# Altium schematic sheet CurrentSense_PowerDistribution.SchDoc
size A; SheetNumber: 3; SheetTotal: 5
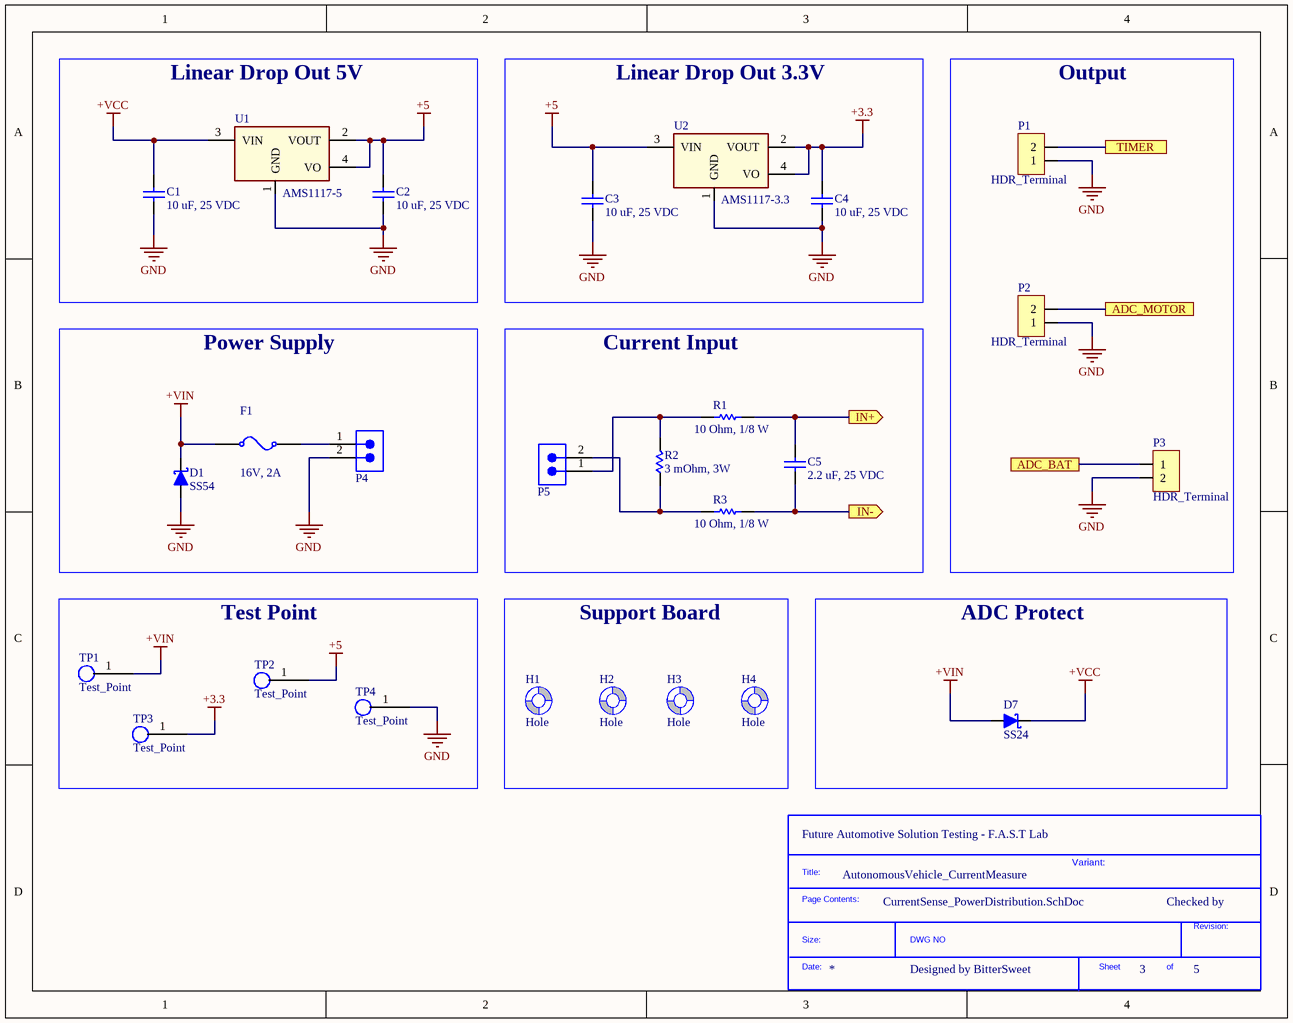
[diagram p0: CurrentSense_PowerDistribution.SchDoc]

## Parts
*?  SDTitleBlock  (value not drawn)  (graphical)
C1  10 uF, 25 VDC  [CAP_0603]
C2  10 uF, 25 VDC  [CAP_0603]
C3  10 uF, 25 VDC  [CAP_0603]
C4  10 uF, 25 VDC  [CAP_0603]
C5  2.2 uF, 25 VDC  [CAP_0805]
D1  SS54  [DO-214AB, SMA]
D7  SS24  [DO-214AB, SMA]
F1  16V, 2A  [Fuse_SMD_1812]
H1  Hole  [Hole_3.2mm]
H2  Hole  [Hole_3.2mm]
H3  Hole  [Hole_3.2mm]
H4  Hole  [Hole_3.2mm]
P1  HDR_Terminal  [HDR_Header_2.54]
P2  HDR_Terminal  [HDR_Header_2.54]
P3  HDR_Terminal  [HDR_Header_2.54]
P4  10A, 300V  [691322310002]  (value not drawn)
P5  10A, 300V  [691322310002]  (value not drawn)
R1  10 Ohm, 1/8 W  [RESISTOR_0805]
R2  3 mOhm, 3W  [RESISTOR-SMD-2512]
R3  10 Ohm, 1/8 W  [RESISTOR_0805]
TP1  Test_Point  [TP_1_5mm_SMD]
TP2  Test_Point  [TP_1_5mm_SMD]
TP3  Test_Point  [TP_1_5mm_SMD]
TP4  Test_Point  [TP_1_5mm_SMD]
U1  AMS1117-5  [AMS1117]
U2  AMS1117-3.3  [AMS1117]

## Blocks framed on the sheet
Linear Drop Out 5V: C1 C2 U1
Linear Drop Out 3.3V: C3 C4 U2
Output: P1-P3
Power Supply: D1 F1 P4
Current Input: C5 P5 R1-R3
Test Point: TP1-TP4
Support Board: H1-H4
ADC Protect: D7

## Ports
ADC_BAT, ADC_MOTOR, IN+ (out), IN- (out), TIMER

## Nets
+3.3: C4.2 TP3.1 U2.2(VOUT) U2.4(VO)
+5: C2.2 C3.2 TP2.1 U1.2(VOUT) U1.4(VO) U2.3(VIN)
+VCC: C1.2 D7.2(K) U1.3(VIN)
+VIN: D1.2(K) D7.1(A) F1.0 TP1.1
GND: C1.1 C2.1 C3.1 C4.1 D1.1(A) P1.1 P2.1 P3.2 P4.2 TP4.1 U1.1(GND) U2.1(GND)
ADC_BAT: P3.1 ; port ADC_BAT
ADC_MOTOR: P2.2 ; port ADC_MOTOR
IN+: C5.2 R1.2 ; port IN+
IN-: C5.1 R3.2 ; port IN-
TIMER: P1.2 ; port TIMER
NetF1_1: F1.1 P4.1
NetP5_1: P5.1 R1.1 R2.2
NetP5_2: P5.2 R2.1 R3.1

Not connected (* = marked no-connect by the designer): H1 1(Screw); H2 1(Screw); H3 1(Screw); H4 1(Screw)

## Notes on the sheet
- (near *?) Future Automotive Solution Testing - F.A.S.T Lab
- AutonomousVehicle_CurrentMeasure
- Variant:
- Checked by
- Designed by BitterSweet
- (in symbol SDTitleBlock) Title:; Page Contents:; Revision:; Size:; DWG NO; Date:; Sheet; of

## Library data of the parts
C1-C4 = 0106031061010: CAP, size 0603, 10 uF, 10 VDC; Manufacture Name: Samsung Electro-Mechanics; Manufacture SN: CL10A106KP8NNWC; Capacitance: 10 uF; Tolerance: +/-10%; Voltage Rating DC: 25 VDC; ComponentLink2Description: Datasheet; ComponentLink2URL: https://www.mouser.vn/datasheet/2/585/MLCC-1837944.pdf; Operating Temperature: -55 to +125degC; Packaging: Tape and Reel; Mounting Technology: SMT; Size: 0603; Supplier 1 Name: Mouser; Supplier 1 SN: 187-CL10A106KP8NNWC; Supplier 1 URL: https://www.mouser.vn/ProductDetail/Samsung-Electro-Mechanics/CL10A106KP8NNWC?qs=xZ%2FP%252Ba9zWqZx8LSX23YqWA%3D%3D&utm_source=mouser-refine-download&utm_medium=file&utm_campaign=CL10A106KP8NNWC&utm_content=Samsung-Electro-Mechanics; Supplier 2 Name: Digi-Key; Supplier 2 SN: 1276-CL10A106KP8NNWCTR-ND; Supplier 2 URL: https://www.digikey.com/en/products/detail/samsung-electro-mechanics/cl10a106kp8nnwc/16572907; Supplier 3 Name: thegioiic; Supplier 3 SN: N/A; Supplier 3 URL: https://www.thegioiic.com/tu-gom-0603-10uf-25v; Value: 10 uF, 25 VDC
C5 = 0108052251025: CAP, size 0805, 2.2 uF, 25 VDC; Manufacture Name: TDK; Manufacture SN: CGA4J3X7R1E225K125AD; Capacitance: 2.2 uF; Tolerance: +/-10%; Voltage Rating DC: 25 VDC; ComponentLink2Description: Datasheet; ComponentLink2URL: https://product.tdk.com/system/files/dam/doc/product/capacitor/ceramic/mlcc/catalog/mlcc_automotive_epoxy_en.pdf?ref_disty=mouser; Operating Temperature: -55 to +125degC; Packaging: Tape and Reel; Mounting Technology: SMT; Size: 0805; Supplier 1 Name: Mouser; Supplier 1 SN: 810-CGA4J3X7R1E225KD; Supplier 1 URL: https://www.mouser.vn/ProductDetail/TDK/CGA4J3X7R1E225K125AD?qs=xLDY6iXSiQZ6drRfaPQTzQ%3D%3D&utm_source=mouser-refine-download&utm_medium=file&utm_campaign=CGA4J3X7R1E225K125AD&utm_content=TDK; Supplier 2 Name: Digi-Key; Supplier 2 SN: 445-9923-2-ND; Supplier 2 URL: https://www.digikey.com/en/products/detail/tdk-corporation/cga4j3x7r1e225k125ad/3933656; Supplier 3 Name: thegioiic; Supplier 3 SN: OEM; Supplier 3 URL: https://www.thegioiic.com/tu-gom-0805-2-2uf-25v; Value: 2.2 uF, 25 VDC
D1 D7 = Diode_Schottky: SS54 SMC Diode Schottky 5A 40V
F1 = 061812200016: Resettable Fuse, Size 1812, 16V, 2A; Manufacturer: Littelfuse; Threshold Current: 40A; Trip Current: 4A; Threshold Voltage: 16V; Hold Current: 2A; Size: 1812; Mounting Technology: SMT/SMD; ComponentLink1Description: Datasheet link; ComponentLink1URL: https://www.littelfuse.com/~/media/electronics/product_specifications/resettable_ptcs/littelfuse_ptc_minismdc300f_2_product_specification.pdf.pdf; ComponentLink2Description: Supplier 1 URL; ComponentLink2URL: https://www.mouser.vn/ProductDetail/Littelfuse/MINISMDC200F-16-2?qs=pBN%2FbMTRZdcH0yqkqvkPxw%3D%3D; ComponentLink3Description: Supplier 2 URL; ComponentLink3URL: https://www.digikey.com/en/products/detail/littelfuse-inc/MINISMDC200F-16-2/6348163?s=N4IgTCBcDaILIEkByCDKcAiBhMAGXAYgPQCMAbALQQC6AvkA; ComponentLink4Description: Supplier 3 URL; ComponentLink4URL: https://www.thegioiic.com/cau-chi-tu-phuc-hoi-1812-16v-2a; Supplier 1 Name: Mouser; Supplier 1 SN: 650-MINISMDC200F/162; Supplier 1 URL: https://www.mouser.vn/ProductDetail/Littelfuse/MINISMDC200F-16-2?qs=pBN%2FbMTRZdcH0yqkqvkPxw%3D%3D; Supplier 2 Name: Digi-Key; Supplier 2 SN: MINISMDC200F/16-2TR-ND; Supplier 2 URL: https://www.mouser.vn/ProductDetail/Littelfuse/MINISMDC200F-16-2?qs=pBN%2FbMTRZdcH0yqkqvkPxw%3D%3D; Supplier 3 Name: thegioiic; Supplier 3 SN: N/A; Supplier 3 URL: https://www.thegioiic.com/cau-chi-tu-phuc-hoi-1812-16v-2a; Value: 16V, 2A
P1-P3 = HDR_Terminal: HDR_Terminal 2 pin; Supplier: ThegioiIC; ComponentLink1Description: URL; ComponentLink1URL: https://www.thegioiic.com/kf128-2-v-domino-2-chan-thang-3-5mm-300v-10a-han-pcb
P4 P5 = 691322310002: WR-TBL Series 322 Horizontal PCB Header, THT, pitch 3.81mm, 2p; Manufacturer: Wurth Elektronik; Modularity: No; ComponentLink1Description: Datasheet Link; ComponentLink1URL: https://www.we-online.com/redexpert/spec/691322310002?ad; ComponentLink2Description: Supplier 1 URL; ComponentLink2URL: N/A; Manufacturer Part Number: 691322310002; Category: Terminal Blocks; Match Code: WR-TBL; Mount: Through Hole; Operating Temperature Max: 105°C; Operating Temperature Min: -40°C; Packaging: Box; Application: Pluggable; Number of Pins: 2; Number of Rows: 1; Orientation: Horizontal; Pitch: 3.81mm; Rated Current: 10A; Working Voltage: 300V; ComponentLink3Description: Supplier 2 URL; ComponentLink3URL: N/A; ComponentLink4Description: Supplier 3 URL; ComponentLink4URL: https://www.thegioiic.com/kf-3-81-2-r-terminal-block-plug-in-han-pcb-2-chan-cong-3-81mm-300v-10a; Supplier 1 Name: Mouser; Supplier 1 SN: N/A; Supplier 1 URL: N/A; Supplier 2 Name: Digi-Key; Supplier 2 SN: N/A; Supplier 2 URL: N/A; Supplier 3 Name: thegioiic; Supplier 3 SN: N/A; Supplier 3 URL: https://www.thegioiic.com/kf-3-81-2-r-terminal-block-plug-in-han-pcb-2-chan-cong-3-81mm-300v-10a; Value: 10A, 300V
R1 R3 = 0008051001: RES, size 0805, 10 Ohm, 1/8 W; Manufacture  Name: Vishay Dale Thin Film; Manufacture  SN: M55342H06B10D0RT5; Resistance tolerance: +/-1%; Rated Power: 1/8 W; Resistance: 10 Ohm; Size: 0805; Mounting Technology: SMT; Supplier 1 Name: Mouser; Supplier 1 SN: 71-CRCW080510R0FKEAH; Supplier 1 URL: https://www.mouser.vn/ProductDetail/Vishay-Dale/CRCW080510R0FKEAHP?qs=sGAEpiMZZMtlubZbdhIBIB2QTI7Ai3Wq221SUXRDybo%3D; Supplier 2 Name: Digi-Key; Supplier 2 SN: 764-M55342H06B10D0RT5TR-ND; Supplier 2 URL: https://www.digikey.com/en/products/detail/vishay-dale-thin-film/M55342H06B10D0RT5/3580812; Supplier 3 Name: Thegioiic; Supplier 3 SN: N/A; Supplier 3 URL: https://www.thegioiic.com/dien-tro-10-ohm-0805-1-; Value: 10 Ohm, 1/8 W; ComponentLink1Description: Datasheet link; ComponentLink1URL: https://www.vishay.com/docs/60018/eh.pdf; ComponentLink2Description: Supplier 1 URL; ComponentLink2URL: https://www.mouser.vn/ProductDetail/Vishay-Dale/CRCW080510R0FKEAHP?qs=sGAEpiMZZMtlubZbdhIBIB2QTI7Ai3Wq221SUXRDybo%3D; ComponentLink3Description: Supplier 2 URL; ComponentLink3URL: https://www.digikey.com/en/products/detail/vishay-dale-thin-film/M55342H06B10D0RT5/3580812; ComponentLink4Description: Supplier 3 URL; ComponentLink4URL: https://www.thegioiic.com/dien-tro-10-ohm-0805-1-
R2 = RESISTOR: MP: NUCLEO-F401RE; Availability: Unavailable; Price: None; Package: None; Value: *; Mouser Link: https://www.mouser.vn/ProductDetail/Bourns/CRE2512-FZ-R003E-3?qs=rpfKl3ntHzPjkfGuk%252BIwsA%3D%3D&srsltid=AfmBOopEgYGycx6kmbnZ21OC9P-p9XnaYC4Ly7xv01NJ0SqXpV2qtA37; Mouser Part: 652-CRE2512FZR003E-3
U1 U2 = AMS1117: IC Linear Drop Out 3.3V 1A SOT-223
  U1: URL: https://www.thegioiic.com/xblw-ams1117-5-0v-ic-on-ap-5v-1a-sot-223
  U2: URL: https://www.thegioiic.com/ams1117-3-3v-ic-on-ap-3-3v-1a-sot-223